# Altium project Custom Transmitter.PrjPcb
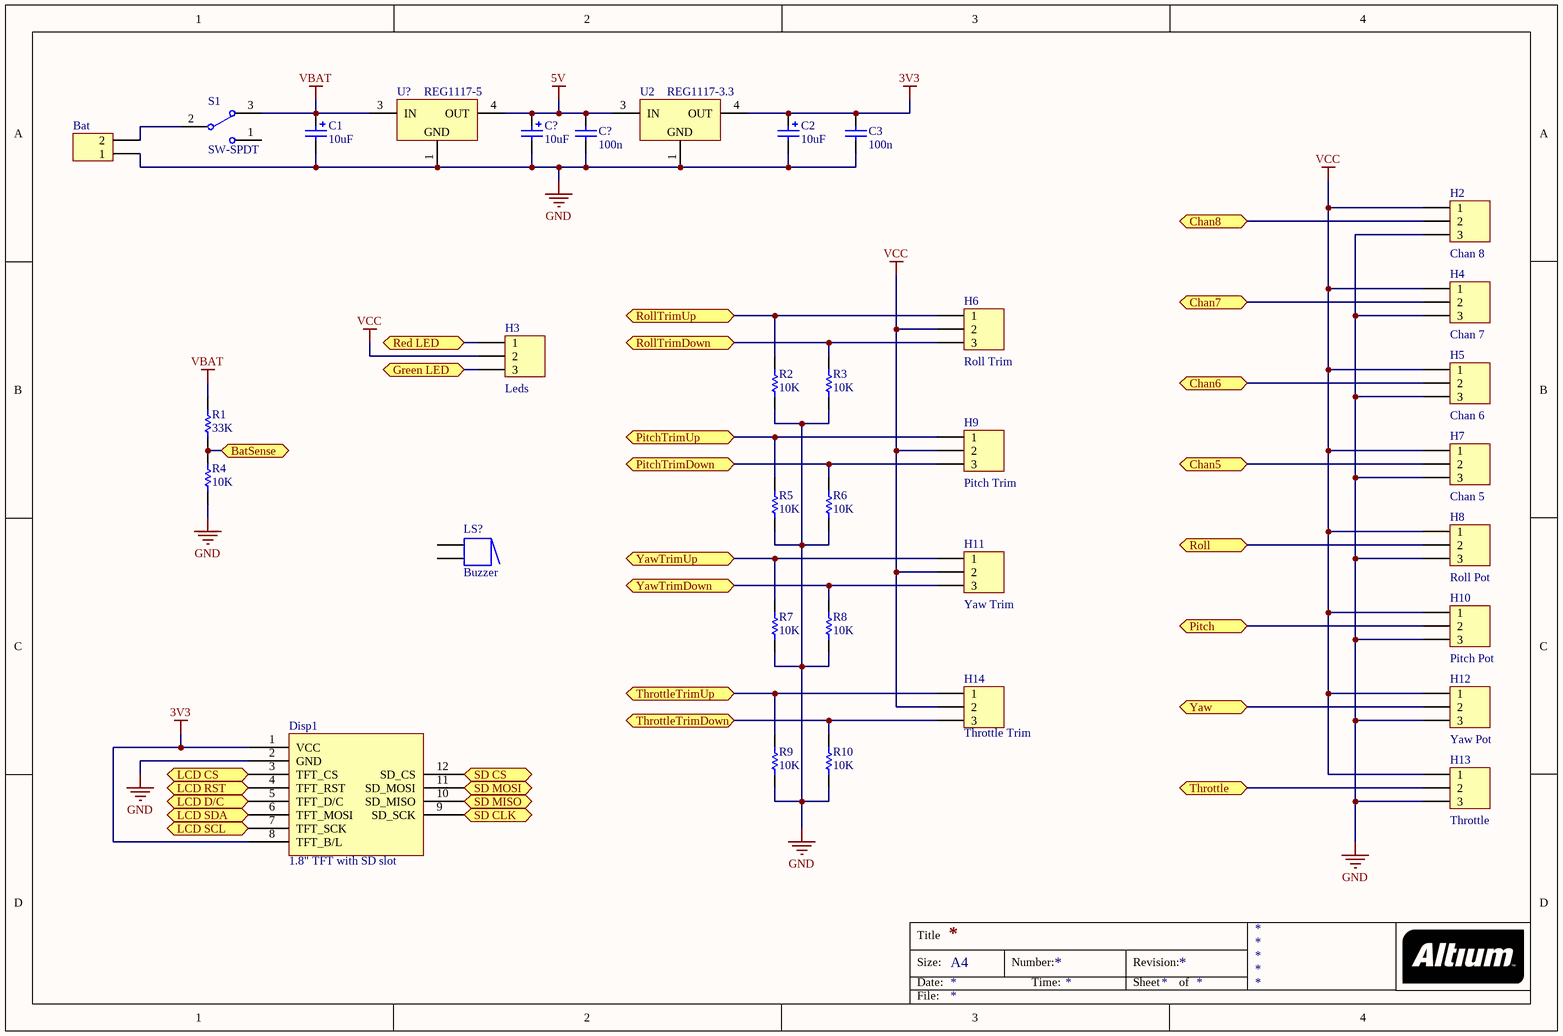
[diagram p0: Main Schematic.SchDoc]
3 sheets, 83 parts. Net scope: flat (ports and power ports of the same name join across sheets).
Board file: Main PCB.PcbDoc
Sheets:
  Main Schematic.SchDoc
  Off Board.SchDoc
  STM32F100RB.SchDoc

## Sheet Main Schematic.SchDoc
size A4

### Parts
(Parts that share a designator on the sheet are numbered #1, #2 ... from top to bottom, then left to right.)
Bat  Header 2  [HDR1X2]  (value not drawn)
C1  value 10uF  [RB.1/.2]  (hidden comment: Cap Pol1)
C2  value 10uF  [RB.1/.2]  (hidden comment: Cap Pol1)
C3  value 100n  [RAD200_A]  (hidden comment: Cap)
C?#1  value 10uF  [RB.1/.2]  (hidden comment: Cap Pol1)
C?#2  value 100n  [RAD200_A]  (hidden comment: Cap)
Disp1  1.8" TFT with SD slot
H2  Chan 8  [HDR1X3]
H3  Leds  [HDR1X3]
H4  Chan 7  [HDR1X3]
H5  Chan 6  [HDR1X3]
H6  Roll Trim  [HDR1X3]
H7  Chan 5  [HDR1X3]
H8  Roll Pot  [HDR1X3]
H9  Pitch Trim  [HDR1X3]
H10  Pitch Pot  [HDR1X3]
H11  Yaw Trim  [HDR1X3]
H12  Yaw Pot  [HDR1X3]
H13  Throttle  [HDR1X3]
H14  Throttle Trim  [HDR1X3]
LS?  Buzzer  [ABSM-1574]
R1  value 33K  [AXIAL200]  (hidden comment: Res)
R2  value 10K  [0805]  (hidden comment: Res)
R3  value 10K  [0805]  (hidden comment: Res)
R4  value 10K  [AXIAL200]  (hidden comment: Res)
R5  value 10K  [0805]  (hidden comment: Res)
R6  value 10K  [0805]  (hidden comment: Res)
R7  value 10K  [0805]  (hidden comment: Res)
R8  value 10K  [0805]  (hidden comment: Res)
R9  value 10K  [0805]  (hidden comment: Res)
R10  value 10K  [0805]  (hidden comment: Res)
S1  SW-SPDT  [TL36WW15050]
U2  REG1117-3.3  [369A-13]
U?  REG1117-5  [369A-13]

### Ports
BatSense, Chan5, Chan6, Chan7, Chan8, Green LED, LCD CS, LCD D/C, LCD RST, LCD SCL, LCD SDA, Pitch, PitchTrimDown, PitchTrimUp, Red LED, Roll, RollTrimDown, RollTrimUp, SD CLK, SD CS, SD MISO, SD MOSI, Throttle, ThrottleTrimDown, ThrottleTrimUp, Yaw, YawTrimDown, YawTrimUp

### Nets
3V3: C2.1 C3.2 Disp1.1(VCC) Disp1.8(TFT_B/L) U2.4(OUT)
5V: C?#1.1 C?#2.2 U2.3(IN) U?.4(OUT)
GND: Bat.1 C1.2 C2.2 C3.1 C?#1.2 C?#2.1 Disp1.2(GND) H2.3 H4.3 H5.3 H7.3 H8.3 H10.3 H12.3 H13.3 R2.1 R3.1 R4.2 R5.1 R6.1 R7.1 R8.1 R9.2 R10.1 U2.1(GND) U?.1(GND)
VBAT: C1.1 R1.1 S1.3 U?.3(IN)
VCC: H2.1 H3.2 H4.1 H5.1 H6.2 H7.1 H8.1 H9.2 H10.1 H11.2 H12.1 H13.1 H14.2
NetBat_2: Bat.2 S1.2
NetDisp1_3: Disp1.3(TFT_CS) ; port LCD CS
NetDisp1_4: Disp1.4(TFT_RST) ; port LCD RST
NetDisp1_5: Disp1.5(TFT_D/C) ; port LCD D/C
NetDisp1_6: Disp1.6(TFT_MOSI) ; port LCD SDA
NetDisp1_7: Disp1.7(TFT_SCK) ; port LCD SCL
NetDisp1_9: Disp1.9(SD_SCK) ; port SD CLK
NetDisp1_10: Disp1.10(SD_MISO) ; port SD MISO
NetDisp1_11: Disp1.11(SD_MOSI) ; port SD MOSI
NetDisp1_12: Disp1.12(SD_CS) ; port SD CS
NetH2_2: H2.2 ; port Chan8
NetH3_1: H3.1 ; port Red LED
NetH3_3: H3.3 ; port Green LED
NetH4_2: H4.2 ; port Chan7
NetH5_2: H5.2 ; port Chan6
NetH6_1: H6.1 R2.2 ; port RollTrimUp
NetH6_3: H6.3 R3.2 ; port RollTrimDown
NetH7_2: H7.2 ; port Chan5
NetH8_2: H8.2 ; port Roll
NetH9_1: H9.1 R5.2 ; port PitchTrimUp
NetH9_3: H9.3 R6.2 ; port PitchTrimDown
NetH10_2: H10.2 ; port Pitch
NetH11_1: H11.1 R7.2 ; port YawTrimUp
NetH11_3: H11.3 R8.2 ; port YawTrimDown
NetH12_2: H12.2 ; port Yaw
NetH13_2: H13.2 ; port Throttle
NetH14_1: H14.1 R9.1 ; port ThrottleTrimUp
NetH14_3: H14.3 R10.2 ; port ThrottleTrimDown
NetLS?_1: LS?.1 LS?.1A
NetLS?_2: LS?.2 LS?.2A
NetR1_2: R1.2 R4.1 ; port BatSense

Not connected (* = marked no-connect by the designer): S1 1

### Notes on the sheet
- Title
- Size:
- Date:
- A4
- Number:
- Time:
- Revision:
- Sheet
- of
- File:

### Library data of the parts
Bat = Header 2: Header, 2-Pin; Manufacturer: Generic Components; Class: Connector
C1 C2 C?#1 = Cap Pol1: Polarized Capacitor (Radial); Manufacturer: Generic Components; Class: Passive; Published: 08/06/2000; Publisher: Altium Hobart Technology Centre; SubClass: Capacitor
C3 C?#2 = Cap: Capacitor; Manufacturer: Generic Components; Class: Passive; Published: 08/06/2000; Publisher: Altium Hobart Technology Centre; SubClass: Capacitor
H2-H14 = Header 3: Header, 3-Pin; Manufacturer: Generic Components; Class: Connector
LS? = Buzzer: Magnetic Transducer Buzzer; Published: 24-Mar-1999; LatestRevisionDate: 17-Dec-2003; LatestRevisionNote: Schematic revised, PCB Footprint replaced.; DatasheetVersion: 17-Dec-2003; PackageReference: ABSM-1574; Publisher: Altium Limited; PackageDescription: Magnetic Transducer Buzzer; ComponentLink1Description: Manufacturer Link; ComponentLink1URL: http://www.megastar.com/linecard/buzzmode/index.php
R1-R10 = Res: Resistor; Manufacturer: Generic Components; Class: Passive; Published: 08/06/2000; Publisher: Altium Hobart Technology Centre; SubClass: Resistor
S1 = SW-SPDT: SPDT Subminiature Toggle Switch, Right Angle Mounting, Vertical Actuation; Published: 24-Mar-1999; LatestRevisionDate: 17-Dec-2003; LatestRevisionNote: Schematic revised, PCB Footprint replaced.; DatasheetVersion: 05-Dec-2000; PackageReference: TL36WW15050; Publisher: Altium Limited; PackageDescription: Switch; 4 Leads; ComponentLink1Description: Manufacturer Link; ComponentLink1URL: http://www.apem.com
U2 U? = REG1117-3.3: 800mA and 1A Low Dropout Positive Regulator 2.85V, 3.3V, 5V, and Adjustable; PackageDocument: revC; Published: 8-Jun-2000; LatestRevisionDate: 17-Jul-2002; LatestRevisionNote: Re-released for DXP Platform.; DatasheetDocument: Sep-1997; PackageReference: ZZ311; Publisher: Altium Limited; ComponentLink1Description: Manufacturer Link; ComponentLink1URL: http://www.ti.com/

## Sheet Off Board.SchDoc
size A4
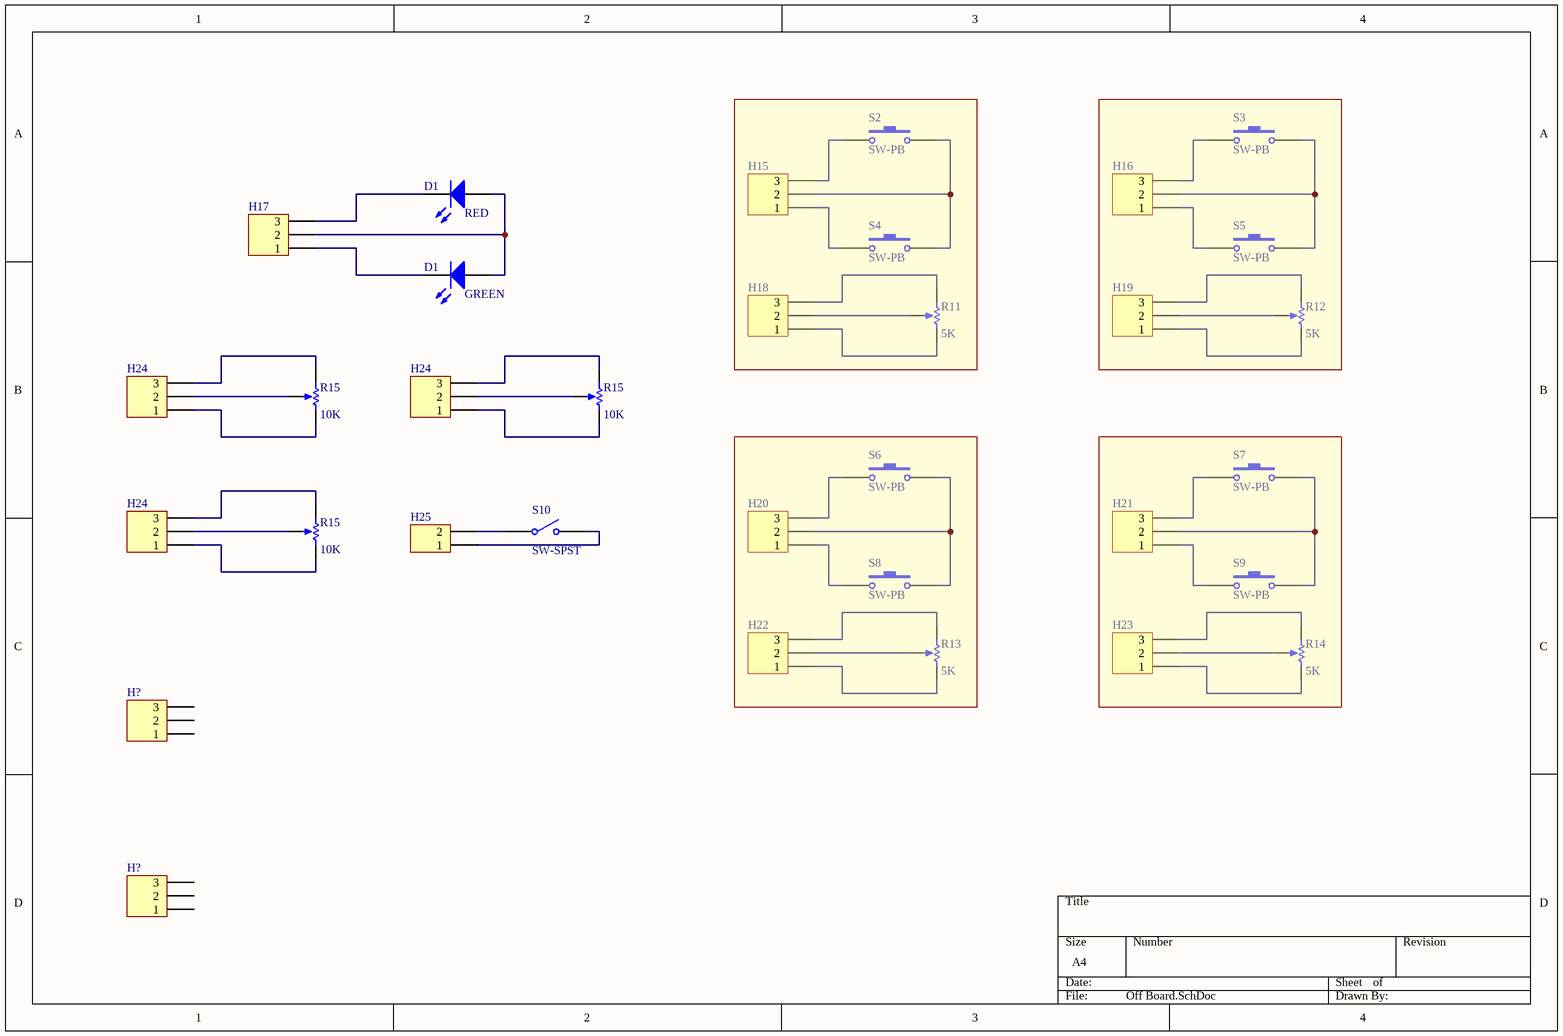
[diagram p1: Off Board.SchDoc]

### Parts
(Parts that share a designator on the sheet are numbered #1, #2 ... from top to bottom, then left to right.)
D1#1  RED  [LED-1]
D1#2  GREEN  [LED-1]
H15  Header 3  [HDR1X3]  (value not drawn)
H16  Header 3  [HDR1X3]  (value not drawn)
H17  Header 3  [HDR1X3]  (value not drawn)
H18  Header 3  [HDR1X3]  (value not drawn)
H19  Header 3  [HDR1X3]  (value not drawn)
H20  Header 3  [HDR1X3]  (value not drawn)
H21  Header 3  [HDR1X3]  (value not drawn)
H22  Header 3  [HDR1X3]  (value not drawn)
H23  Header 3  [HDR1X3]  (value not drawn)
H24#1  Header 3  [HDR1X3]  (value not drawn)
H24#2  Header 3  [HDR1X3]  (value not drawn)
H24#3  Header 3  [HDR1X3]  (value not drawn)
H25  Header 2  [HDR1X2]  (value not drawn)
H?#1  Header 3  [HDR1X3]  (value not drawn)
H?#2  Header 3  [HDR1X3]  (value not drawn)
R11  value 5K  [RES_TRIM_200]  (hidden comment: RPot)
R12  value 5K  [RES_TRIM_200]  (hidden comment: RPot)
R13  value 5K  [RES_TRIM_200]  (hidden comment: RPot)
R14  value 5K  [RES_TRIM_200]  (hidden comment: RPot)
R15#1  value 10K  [RES_TRIM_200]  (hidden comment: RPot)
R15#2  value 10K  [RES_TRIM_200]  (hidden comment: RPot)
R15#3  value 10K  [RES_TRIM_200]  (hidden comment: RPot)
S2  SW-PB  [SPST-2]
S3  SW-PB  [SPST-2]
S4  SW-PB  [SPST-2]
S5  SW-PB  [SPST-2]
S6  SW-PB  [SPST-2]
S7  SW-PB  [SPST-2]
S8  SW-PB  [SPST-2]
S9  SW-PB  [SPST-2]
S10  SW-SPST  [SPST-2]

### Nets
NetD1#1_1: D1#1.1(A) D1#2.1(A) H17.2
NetD1#1_2: D1#1.2(K) H17.3
NetD1#2_2: D1#2.2(K) H17.1
NetH15_1: H15.1 S4.1
NetH15_2: H15.2 S2.2 S4.2
NetH15_3: H15.3 S2.1
NetH16_1: H16.1 S5.1
NetH16_2: H16.2 S3.2 S5.2
NetH16_3: H16.3 S3.1
NetH18_1: H18.1 R11.2(BOT)
NetH18_2: H18.2 R11.3(TAP)
NetH18_3: H18.3 R11.1(TOP)
NetH19_1: H19.1 R12.2(BOT)
NetH19_2: H19.2 R12.3(TAP)
NetH19_3: H19.3 R12.1(TOP)
NetH20_1: H20.1 S8.1
NetH20_2: H20.2 S6.2 S8.2
NetH20_3: H20.3 S6.1
NetH21_1: H21.1 S9.1
NetH21_2: H21.2 S7.2 S9.2
NetH21_3: H21.3 S7.1
NetH22_1: H22.1 R13.2(BOT)
NetH22_2: H22.2 R13.3(TAP)
NetH22_3: H22.3 R13.1(TOP)
NetH23_1: H23.1 R14.2(BOT)
NetH23_2: H23.2 R14.3(TAP)
NetH23_3: H23.3 R14.1(TOP)
NetH24#1_1: H24#1.1 R15#1.2(BOT)
NetH24#1_2: H24#1.2 R15#1.3(TAP)
NetH24#1_3: H24#1.3 R15#1.1(TOP)
NetH24#2_1: H24#2.1 R15#2.2(BOT)
NetH24#2_2: H24#2.2 R15#2.3(TAP)
NetH24#2_3: H24#2.3 R15#2.1(TOP)
NetH24#3_1: H24#3.1 R15#3.2(BOT)
NetH24#3_2: H24#3.2 R15#3.3(TAP)
NetH24#3_3: H24#3.3 R15#3.1(TOP)
NetH25_1: H25.1 S10.2(NO)
NetH25_2: H25.2 S10.1(COMMON)

Not connected (* = marked no-connect by the designer): H?#1 1 2 3; H?#2 1 2 3

### Library data of the parts
D1#1 D1#2 = LED1: Typical RED GaAs LED; Published: 8-Jun-2000; LatestRevisionDate: 08-Jul-2005; LatestRevisionNote: Mech Layer 1 removed.; PackageReference: LED-1; Publisher: Altium Limited; PackageDescription: LED; 2 Leads
H15-H23 H24#1-H24#3 H?#1 H?#2 = Header 3: as H2 on sheet Main Schematic
H25 = Header 2: as Bat on sheet Main Schematic
R11-R14 R15#1-R15#3 = RPot: Potentiometer; Manufacturer: Generic Components; Class: Passive; Set Position: 0.5; Published: 08/06/2000; Publisher: Altium Hobart Technology Centre; SubClass: Potentiometer
S2-S9 = SW-PB: Switch; Published: 24-Mar-1999; LatestRevisionDate: 17-Jul-2002; LatestRevisionNote: Re-released for DXP Platform.; PackageReference: SPST-2; Publisher: Altium Limited; PackageDescription: Switch; 2 Leads
S10 = SW-SPST: Single-Pole, Single-Throw Switch; Published: 24-Mar-1999; LatestRevisionDate: 17-Jul-2002; LatestRevisionNote: Re-released for DXP Platform.; PackageReference: SPST-2; Publisher: Altium Limited; PackageDescription: Switch; 2 Leads

## Sheet STM32F100RB.SchDoc
size A4
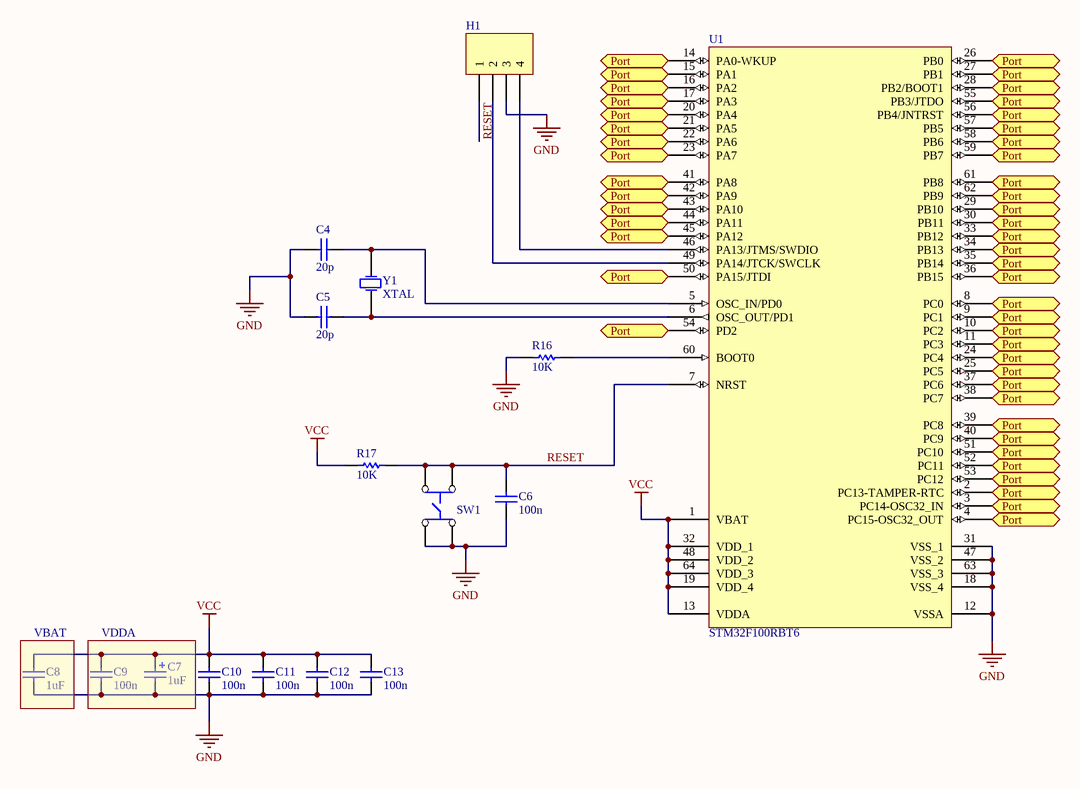
[diagram p2: STM32F100RB.SchDoc]

### Parts
C4  value 20p  [0805]  (hidden comment: Cap)
C5  value 20p  [0805]  (hidden comment: Cap)
C6  value 100n  [0805]  (hidden comment: Cap)
C7  value 1uF  [RB.1/.2]  (hidden comment: Cap Pol1)
C8  value 1uF  [0805]  (hidden comment: Cap)
C9  value 100n  [0805]  (hidden comment: Cap)
C10  value 100n  [0805]  (hidden comment: Cap)
C11  value 100n  [0805]  (hidden comment: Cap)
C12  value 100n  [0805]  (hidden comment: Cap)
C13  value 100n  [0805]  (hidden comment: Cap)
H1  Header 4  [HDR1X4]  (value not drawn)
R16  value 10K  [0805]  (hidden comment: Res)
R17  value 10K  [0805]  (hidden comment: Res)
SW1  SW_PB  [SW_PB]  (value not drawn)
U1  STM32F100RBT6  [LQFP64_N]
Y1  XTAL  [XTAL]

### Blocks framed on the sheet
VBAT: C8
VDDA: C7 C9

### Ports
Port

### Nets
GND: C4.1 C5.1 C6.1 C7.2 C8.1 C9.1 C10.1 C11.1 C12.1 C13.1 H1.3 R16.2 SW1.1 SW1.3 U1.12(VSSA) U1.18(VSS_4) U1.31(VSS_1) U1.47(VSS_2) U1.63(VSS_3)
VCC: C7.1 C8.2 C9.2 C10.2 C11.2 C12.2 C13.2 R17.1 U1.1(VBAT) U1.13(VDDA) U1.19(VDD_4) U1.32(VDD_1) U1.48(VDD_2) U1.64(VDD_3)
RESET: C6.2 H1.1 R17.2 SW1.2 SW1.4 U1.7(NRST)
NetC4_2: C4.2 U1.5(OSC_IN/PD0) Y1.2(OSC2)
NetC5_2: C5.2 U1.6(OSC_OUT/PD1) Y1.1(OSC1)
NetH1_2: H1.2 U1.49(PA14/JTCK/SWCLK)
NetH1_4: H1.4 U1.46(PA13/JTMS/SWDIO)
NetR16_1: R16.1 U1.60(BOOT0)
NetU1_2: U1.2(PC13-TAMPER-RTC) U1.3(PC14-OSC32_IN) U1.4(PC15-OSC32_OUT) U1.8(PC0) U1.9(PC1) U1.10(PC2) U1.11(PC3) U1.14(PA0-WKUP) U1.15(PA1) U1.16(PA2) U1.17(PA3) U1.20(PA4) U1.21(PA5) U1.22(PA6) U1.23(PA7) U1.24(PC4) U1.25(PC5) U1.26(PB0) U1.27(PB1) U1.28(PB2/BOOT1) U1.29(PB10) U1.30(PB11) U1.33(PB12) U1.34(PB13) U1.35(PB14) U1.36(PB15) U1.37(PC6) U1.38(PC7) U1.39(PC8) U1.40(PC9) U1.41(PA8) U1.42(PA9) U1.43(PA10) U1.44(PA11) U1.45(PA12) U1.50(PA15/JTDI) U1.51(PC10) U1.52(PC11) U1.53(PC12) U1.54(PD2) U1.55(PB3/JTDO) U1.56(PB4/JNTRST) U1.57(PB5) U1.58(PB6) U1.59(PB7) U1.61(PB8) U1.62(PB9) ; port Port

### Library data of the parts
C4-C6 C8-C13 = Cap: as C3 on sheet Main Schematic; Published: 08/06/2000; Publisher: Altium Hobart Technology Centre; SubClass: Capacitor
C7 = Cap Pol1: as C1 on sheet Main Schematic; Published: 08/06/2000; Publisher: Altium Hobart Technology Centre; SubClass: Capacitor
H1 = Header 4: Header, 4-Pin; Manufacturer: Generic Components; Class: Connector
R16 R17 = Res: as R1 on sheet Main Schematic; Published: 08/06/2000; Publisher: Altium Hobart Technology Centre; SubClass: Resistor
U1 = STM32F100RBT6: STM32 ARM-based 32-bit MCU with 128 Kbytes Flash, 64-pin LQFP, Industrial Temperature; Published: 30-May-2008; PackageVersion: Mar-2008; PackageReference: LQFP64; Publisher: Altium Limited; PackageDescription: 64-Pin Low-Profile Quad Flat Pack, 10 x 10 mm Body, 0.5 mm Pitch (LQFP64); ComponentLink1Description: Manufacturer Link; ComponentLink1URL: www.st.com/stm32; ComponentLink2Description: Datasheet

## Nets that join several sheets
GND: Main Schematic (26 pins), STM32F100RB (19 pins)
VCC: Main Schematic (13 pins), STM32F100RB (14 pins)